# Altium schematic sheet Channel_3.SchDoc
size A4
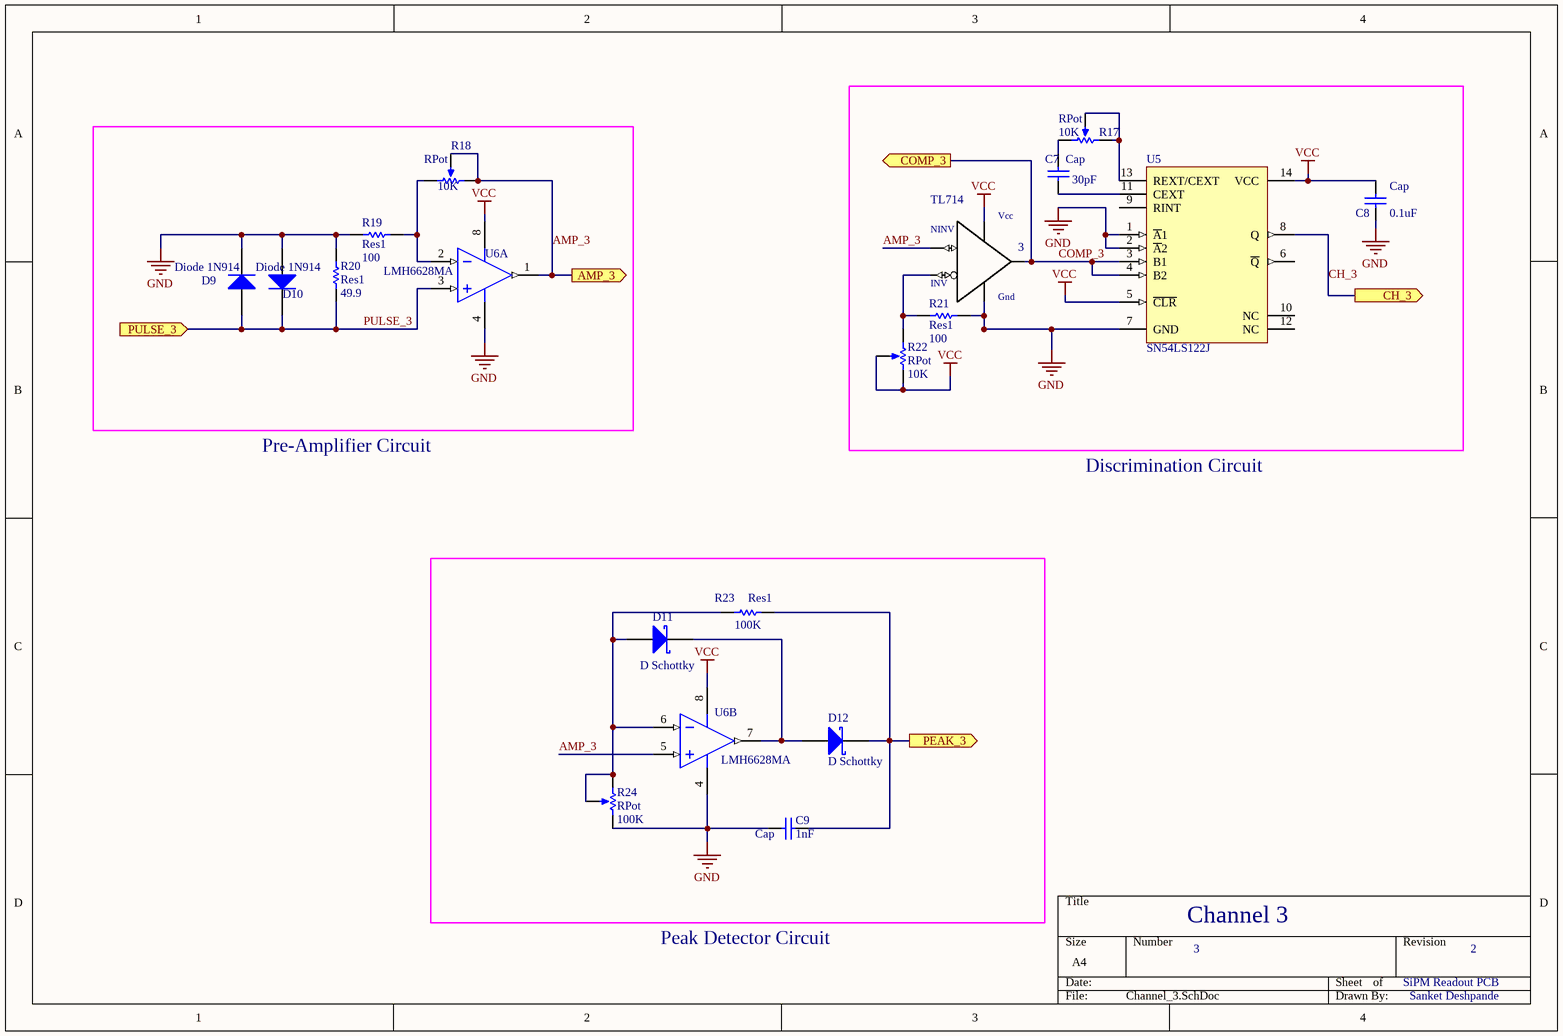
[diagram p0: Channel_3.SchDoc]

## Parts
3  TL714  [SO-08M]
C7  Cap  value 30pF  [RAD-0.3]
C8  Cap  value 0.1uF  [RAD-0.3]
C9  Cap  value 1nF  [RAD-0.3]
D9  Diode 1N914  [DO-35]
D10  Diode 1N914  [DO-35]
D11  D Schottky  [SMB]
D12  D Schottky  [SMB]
R17  RPot  value 10K  [VR5]
R18  RPot  value 10K  [VR5]
R19  Res1  value 100  [AXIAL-0.3]
R20  Res1  value 49.9  [AXIAL-0.3]
R21  Res1  value 100  [AXIAL-0.3]
R22  RPot  value 10K  [VR5]
R23  Res1  value 100K  [AXIAL-0.3]
R24  RPot  value 100K  [VR5]
U5  SN54LS122J  [J014]
U6  LMH6628MA  [M08A_N]  (parts A,B of 2)

## Ports
AMP_3 (out), CH_3 (out), COMP_3 (out), PEAK_3 (out), PULSE_3 (in)

## Nets
GND: 3.5(VNEG) C8.1 C9.1 D9.2(K) D10.1(A) R19.1 R20.1 R21.2 R24.2(BOT) U5.1(~{A}1) U5.2(~{A}2) U5.7(GND) U6.4(V-)
VCC: 3.8(VPOS) C8.2 R22.2(BOT) R22.3(TAP) U5.5(~{CLR}) U5.14(VCC) U6.8(V+)
AMP_3: 3.3(NINV) R18.1(TOP) R18.3(TAP) U6.1(OUT1) U6.5(IN2+) ; port AMP_3
CH_3: U5.8(Q) ; port CH_3
COMP_3: 3.6(OUT) U5.3(B1) U5.4(B2) ; port COMP_3
PEAK_3: C9.2 D12.2(K) R23.2 ; port PEAK_3
PULSE_3: D9.1(A) D10.2(K) R20.2 U6.3(IN1+) ; port PULSE_3
Net3_2: 3.2(INV) R21.1 R22.1(TOP)
NetC7_1: C7.1 U5.11(CEXT)
NetC7_2: C7.2 R17.2(BOT)
NetD11_1: D11.1(A) R23.1 R24.1(TOP) R24.3(TAP) U6.6(IN2-)
NetD11_2: D11.2(K) D12.1(A) U6.7(OUT2)
NetR17_1: R17.1(TOP) R17.3(TAP) U5.13(REXT/CEXT)
NetR18_2: R18.2(BOT) R19.2 U6.2(IN1-)

Not connected (* = marked no-connect by the designer): U5 6(~{Q}) 9(RINT) 10(NC) 12(NC)

## Notes on the sheet
- Pre-Amplifier Circuit
- Discrimination Circuit
- Channel 3
- Peak Detector Circuit
- 3
- SiPM Readout PCB
- 2
- Sanket Deshpande
- (in symbol TL714) Vcc; Gnd

## Library data of the parts
3 = TL714: The TL714C is a high-speed differential comparator fabricated with bipolar Schottky process technology. The circuit h...; MF: Texas Instruments; SnapEDA_Link: https://www.snapeda.com/parts/TL714/Texas%20Instruments/view-part/?ref=snap; Availability: Unavailable; MP: TL714; Package: None; Price: None; Value: *
C7-C9 = Cap: Capacitor; Published: 8-Jun-2000; LatestRevisionDate: 17-Jul-2002; LatestRevisionNote: Re-released for DXP Platform.; PackageReference: RAD-0.3; Publisher: Altium Limited; PackageDescription: Radial Cap, Thru-Hole; 2 Leads; 0.3 in Pin Spacing
D9 D10 = Diode 1N914: High Conductance Fast Diode; Published: 8-Jun-2000; LatestRevisionDate: 17-Jul-2002; LatestRevisionNote: Re-released for DXP Platform.; DatasheetVersion: 1997; PackageReference: DO-35; Publisher: Altium Limited; PackageDescription: Diode, Axial; Body 3.8 x 1.9 mm (LxDia. max), Lead Dia. 0.53 mm (max); Code_JEDEC: DO-204-AH; ComponentLink1Description: Manufacturer Link; ComponentLink1URL: http://www.fairchildsemi.com/; ComponentLink2Description: Datasheet; ComponentLink2URL: http://www.fairchildsemi.com/ds/1N%2F1N4448.pdf
D11 D12 = D Schottky: Schottky Diode; Published: 8-Jun-2000; LatestRevisionDate: 17-Jul-2002; LatestRevisionNote: Re-released for DXP Platform.; PackageReference: SMB; Publisher: Altium Limited; PackageDescription: DO-214-AA/SMB; 2 C-Bend Leads; Body 5.3 x 3.6 mm, inc. leads (LxW); Code_JEDEC: DO-214-AA
R17 R18 R22 R24 = RPot: Potentiometer; Sim Note: Enter the Resistance value and the set point into parameter fields.; Set Position: 0.5; Published: 8-Jun-2000; LatestRevisionDate: 17-Jul-2002; LatestRevisionNote: Re-released for DXP Platform.; PackageReference: VR5; Publisher: Altium Limited; PackageDescription: Variable Resistor, Thru-Hole; 3 Leads
R19-R21 R23 = Res1: Resistor; Published: 8-Jun-2000; LatestRevisionDate: 17-Jul-2002; LatestRevisionNote: Re-released for DXP Platform.; PackageReference: AXIAL-0.3; Publisher: Altium Limited; PackageDescription: Axial Device, Thru-Hole; 2 Leads; 0.3 in Pin Spacing
U5 = SN54LS122J: Retriggerable Monostable Multivibrator; Note: Pins No 10 and 12 are not connected and not drawn; Published: 8-Jun-2000; LatestRevisionDate: 04-Mar-2005; LatestRevisionNote: Stylized 3D Model Added.; DatasheetVersion: Mar-1988; PackageVersion: Jun-1999; PackageReference: J014; Publisher: Altium Limited; PackageDescription: DIP; 14 Leads; Row Spacing 7.62 mm; Pitch 2.54 mm; ComponentLink1Description: Manufacturer Link; ComponentLink1URL: http://www.ti.com/; ComponentLink2Description: Datasheet; ComponentLink2URL: http://www-s.ti.com/sc/ds/sn54ls123.pdf
U6 = LMH6628MA: Dual Wideband, Low Noise, Voltage Feedback Op Amp, 8-pin Narrow SOIC; Manufacturer: National Semiconductor; PackageTopMarking: NSZXTT*LMH66*28MA; PowerWise: Y; CompType: Amplifiers; DatasheetVersion: May-2005; PackageVersion: revM, May-2009; PackageReference: M08A; PackageDescription: SOIC Narrow, 4.9 x 3.9 x 1.45mm, 8 Lead, 1.27mm Pitch; PartNumber: LMH6628MA; RoHS: N; PinCount: 8; High-Reliability: Y; Code_JEDEC: MS-012-AA; Code_IPC: SOIC127P600-8; ComponentLink1Description: Manufacturer URL; ComponentLink1URL: http://www.national.com/; ComponentLink2Description: LMH6628 Datasheet; ComponentLink2URL: http://www.national.com/ds/LM/LMH6628.pdf; ComponentLink3Description: LMH6628 Web Page; ComponentLink3URL: http://www.national.com/pf/LM/LMH6628.html; ComponentLink4Description: M08A Package Page; ComponentLink4URL: http://www.national.com/packaging/folders/m08a.html